# EAGLE design Dimmer (EAGLE 6.3)
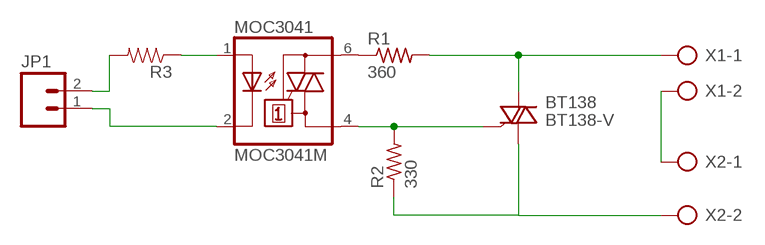
[diagram p0: schematic, sheet 1]

## Parts
BT138  BT138-V  [TO220BV]
JP1  M02PTH  [1X02]
MOC3041  MOC3041M  [DIL06]
R1  360  R-US_0309/V  [0309V]
R2  330  R-US_0309/V  [0309V]
R3  RESISTOR0603-RES  [0603-RES]
X1  AK500/2  [AK500/2]
X2  AK500/2  [AK500/2]

## Nets
N$1: MOC3041.6(A2) R1.1
N$2: X1.2 X2.1
N$3: BT138.G MOC3041.4(A1) R2.2
N$4: BT138.T1(A1) R2.1 X2.2
N$5: BT138.T2(A2) R1.2 X1.1
N$8: MOC3041.1(A) R3.1
N$9: JP1.1 MOC3041.2(C)
N$10: JP1.2 R3.2

## Library data of the parts
BT138 = triac:BT138: TRIAC Source: http://www.semiconductors.philips.com BT138_SERIES_2.pdf
JP1 = SparkFun-Connectors:M02: Header 2 Standard 2-pin 0.1" header. Use with straight break away headers (SKU : PRT-00116), right angle break away headers (PRT-00553), swiss pins (PRT-00743), machine pins (PRT-00117), and female headers (PRT-00115). Molex polarized connector foot print use with SKU : PRT-08233 with associated crimp pins and housings.
MOC3041 = optocoupler:MOC30*: 6-Pin DIP Zero-Cross Optoisolators Triac Driver Output (250/400 Volt Peak) Source: http://www.fairchildsemi.com/ds/MO/MOC3043-M.pdf; MF: FAIRCHILD SEMICONDUCTOR; MPN: MOC3041M; OC_FARNELL: 1086677; OC_NEWARK: 78K6090
R1 R2 = resistor:R-US_: RESISTOR, American symbol
R3 = SparkFun-Passives:RESISTOR: Resistor Basic schematic elements and footprints for 0603, 1206, and PTH resistors.
X1 X2 = con-ptr500:AK500/2: CONNECTOR; OC_FARNELL: unknown; OC_NEWARK: unknown

## Board
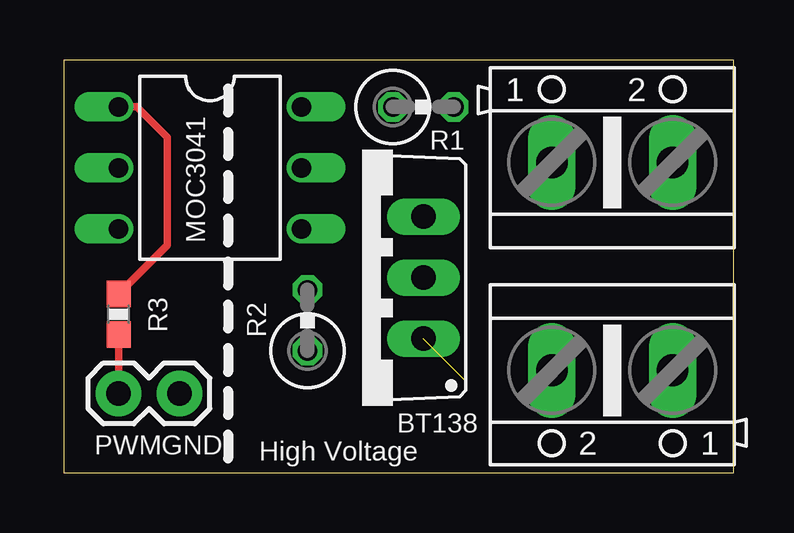
[diagram p1: board, top side]
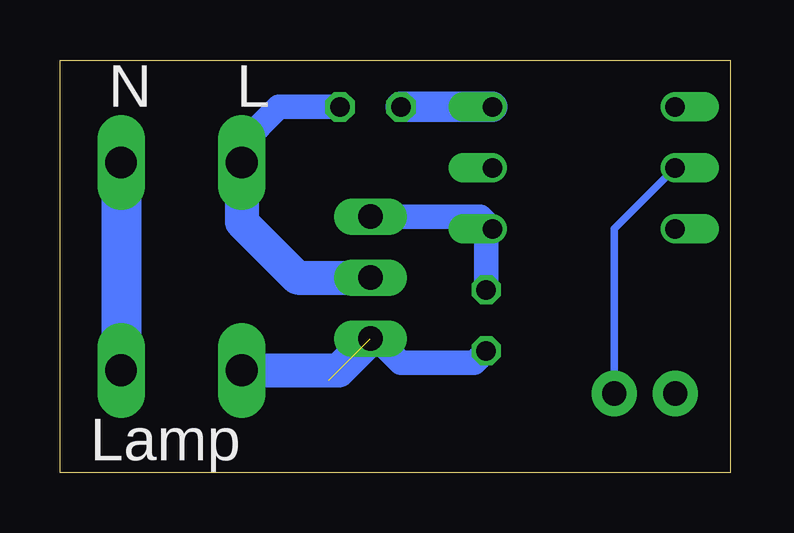
[diagram p2: board, bottom side, seen from below]

Size 27.92 x 17.2 mm. Coordinates in mm from the lower left corner, seen from the top.
Outline: 0,0 27.92,0 27.92,17.2 0,17.2 0,0
Copper layers (1*16): Top 0.0356mm / dielectric 1.5011mm / Bottom 0.0356mm
Design rules "LaenPCBOrder": minimum track width 6mil, minimum drill 13mil, track to track 6mil, track to pad 6mil, pad to pad 6mil, via to via 6mil, smd to smd 6mil, copper to edge 15mil, drill to drill 6mil, minimum pad ring 7mil, minimum via ring 7mil, stop-mask expansion 4mil, vias tented up to drill 0mil, thermal gap 10mil

### Footprints (pad centres in the part's own frame; a part is rotated, then mirrored left to right if it is on the bottom)
TO220BV = drill 1.016 long: G 2.54,-2.54; T1 -2.54,-2.54; T2 0,-2.54
1X02 = drill 1.016 pad 1.88: 1 0,0; 2 2.54,0
DIL06 = drill 0.813 offset: 1 -2.54,-3.81; 2 0,-3.81; 3 2.54,-3.81; 4 2.54,3.81; 5 0,3.81; 6 -2.54,3.81
0309V = drill 0.813 octagon: 1 -1.27,0; 2 1.27,0
0603-RES = smd 1.1 x 1: 1 -0.85,0; 2 0.85,0
AK500/2 = drill 1.321 long: 1 -2.515,0; 2 2.515,0

### Placement (x,y rotation side)
BT138  12.45,8.13 90 top
JP1  4.83,3.3 180 top
MOC3041  6.1,12.7 270 top
R1  14.99,15.24 0 top
R2  10.16,6.35 90 top
R3  2.29,6.6 270 top
X1  22.86,12.93 0 top
X2  22.86,4.27 180 top

### Tracks (layer width: path | path; a pad name or v marks a point on that pad's centre or on a via)
N$1
  Bottom 1.27: R1.1 MOC3041.6
N$2
  Bottom 1.676: X1.2 X2.1
N$3
  Bottom 1.016: BT138.G 10.41,10.67 MOC3041.4 10.16,9.91 R2.2
N$4  (1 unrouted)
  Bottom 1.016: R2.1 10.67,4.57 13.72,4.57 14.73,5.59 BT138.T1
  Bottom 1.422: X2.2 16.31,4.27 BT138.T1
N$5
  Bottom 1.016: X1.1 20.34,13.69 18.8,15.24 R1.2
  Bottom 1.422: X1.1 20.34,10.44 18.03,8.13 BT138.T2
N$8
  Top 0.305: R3.1 4.32,9.49 4.32,13.97 3.05,15.24 MOC3041.1
N$9
  Bottom 0.305: MOC3041.2 4.83,10.16 JP1.1
N$10
  Top 0.305: R3.2 JP1.2

### Text on the board
tNames: PWM | GND | High Voltage
bNames: L | N | Lamp